# EasyEDA Pro project MIC.eprj

# Schematic Schematic1
Board Name: Board1; Create Date: 2024-11-22; Page Name: P1; Project Name: MIC; Schematic Name: Schematic1; Update Date: 2024-12-03; Company: 嘉立创EDA; Page Size: A4; Version: V1.0
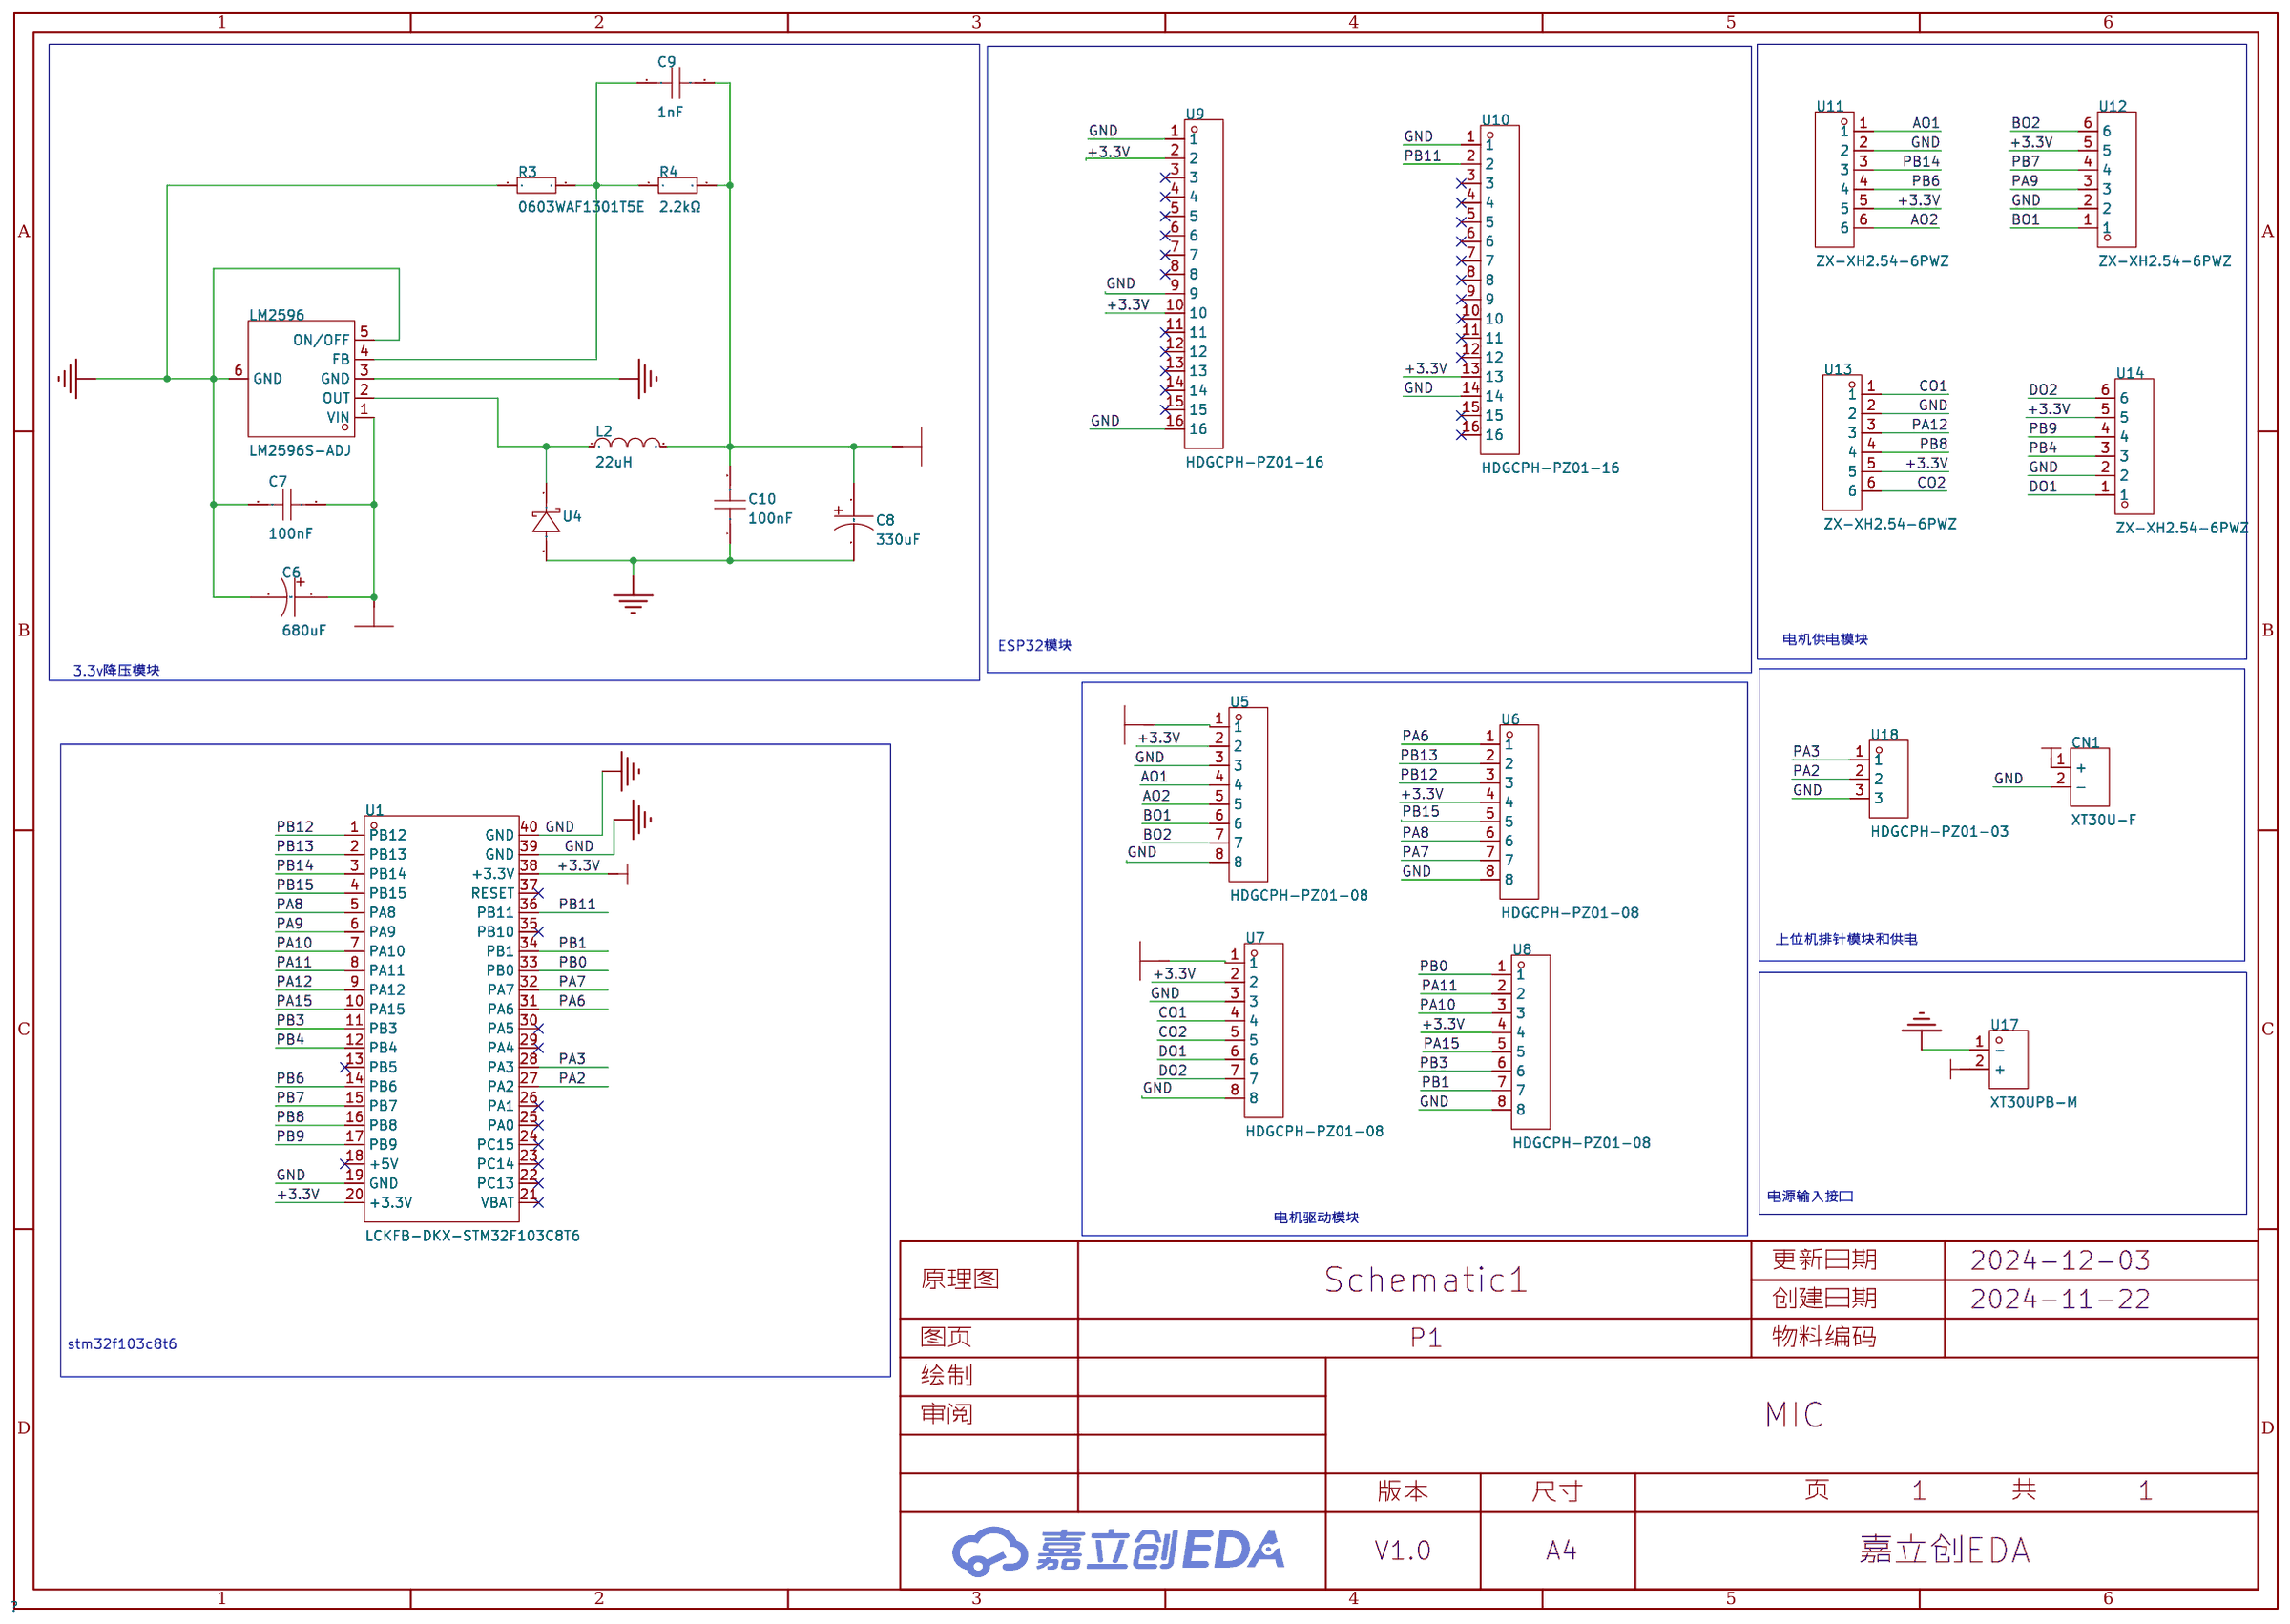
[diagram p0: schematic sheet]

## Parts
C6  680uF  [CAP-TH_BD10.0-P5.00-D1.0-FD]
C7  100nF  [C0805]
C8  330uF  [CAP-TH_BD10.0-P5.00-D1.0-FD]
C9  1nF  [C0603]
C10  100nF  [C0603]
CN1  XT30U-F  [CONN-TH_XT30U-F]
L2  22uH  [IND-SMD_L7.3-W6.6_MHCI06030]
LM2596  LM2596S-ADJ  [TO-263-5_L10.0-W8.4-P1.70-LS15.3-BR]
R3  0603WAF1301T5E  [R0603]
R4  2.2kΩ  [R0603]
U1  LCKFB-DKX-STM32F103C8T6  [CONN-TH_L53.3-W22.9_STM32F103C8T6-CARD]
U4  CDBC540-G  [SMC_L6.9-W5.9-LS7.9-RD]
U5  HDGCPH-PZ01-08  [HDR-TH_8P-P2.54-V-M]
U6  HDGCPH-PZ01-08  [HDR-TH_8P-P2.54-V-M]
U7  HDGCPH-PZ01-08  [HDR-TH_8P-P2.54-V-M]
U8  HDGCPH-PZ01-08  [HDR-TH_8P-P2.54-V-M]
U9  HDGCPH-PZ01-16  [HDR-TH_16P-P2.54-V-M_1]
U10  HDGCPH-PZ01-16  [HDR-TH_16P-P2.54-V-M_1]
U11  ZX-XH2.54-6PWZ  [CONN-TH_6P-P2.50_ZX-XH2.54-6PWZ]
U12  ZX-XH2.54-6PWZ  [CONN-TH_6P-P2.50_ZX-XH2.54-6PWZ]
U13  ZX-XH2.54-6PWZ  [CONN-TH_6P-P2.50_ZX-XH2.54-6PWZ]
U14  ZX-XH2.54-6PWZ  [CONN-TH_6P-P2.50_ZX-XH2.54-6PWZ]
U17  XT30UPB-M  [CONN-TH_XT30UPB-M]
U18  HDGCPH-PZ01-03  [HDR-TH_3P-P2.54-V-M-3]

## Library data of the parts
C6 = LKME1601V681MF: 纹波电流:2.12A 100kHz;容值:680uF;电容体直径:10mm;电容体长度:16mm;等效串联电阻:-;精度:±20%;工作温度:-;脚间距:5mm;额定电压:35V;工作寿命:10000hrs 105℃;; LCSC Part Name: 680uF 35V; Supplier Part: C442883; Manufacturer: Ymin(永铭); Supplier Footprint: 径向引线,10x16mm; JLCPCB Part Class: Extended Part; Datasheet: https://atta.szlcsc.com/upload/public/pdf/source/20191118/C442883_BAFD5D3D4BE15482383085AB86932EA1.pdf; Supplier: LCSC; Ripple Current: 2.12A 100kHz; φD: 10mm; L: 16mm; Tolerance: ±20%; Lead Spacing: 5mm; Rated Voltage: 35V; Lifetime @ Temp: 10000hrs 105℃
C7 = CC0805KKX7R0BB104: LCSC Part Name: 100nF ±10% 100V; Supplier Part: C106243; Manufacturer: YAGEO(国巨); Supplier Footprint: 0805; JLCPCB Part Class: Extended Part; Datasheet: https://atta.szlcsc.com/upload/public/pdf/source/20170505/1493951378248.pdf; Supplier: LCSC; Tolerance: ±10%; Voltage Rated: 100V; Temperature Coefficient: X7R
C8 = ERE1HM331G16OT: LCSC Part Name: 330uF 50V; Supplier Part: C106503; Manufacturer: AISHI(艾华集团); Supplier Footprint: 径向引线,10x16mm; JLCPCB Part Class: Extended Part; Datasheet: https://atta.szlcsc.com/upload/public/pdf/source/20170415/1492238008473.pdf; Supplier: LCSC; L: 16mm; Lifetime @ Temp: 3000hrs 105℃; Rated Voltage: 50V; Tolerance: ±20%; φD: 10mm; Lead Spacing: 5mm
C9 = CL10B102KB8NNNC: LCSC Part Name: 1nF ±10% 50V; Supplier Part: C1588; Manufacturer: SAMSUNG(三星); Supplier Footprint: 0603; JLCPCB Part Class: Basic Part; Datasheet: https://atta.szlcsc.com/upload/public/pdf/source/20160103/1457707679526.pdf; Supplier: LCSC; Tolerance: ±10%; Voltage Rated: 50V; Temperature Coefficient: X7R
C10 = CC0603KRX7R9BB104: LCSC Part Name: 100nF ±10% 50V; Supplier Part: C14663; Manufacturer: YAGEO(国巨); Supplier Footprint: 0603; JLCPCB Part Class: Basic Part; Datasheet: https://atta.szlcsc.com/upload/public/pdf/source/20170116/1484561234239.pdf; Supplier: LCSC; Tolerance: ±10%; Voltage Rated: 50V; Temperature Coefficient: X7R
CN1 = XT30U-F: LCSC Part Name: AMASS(艾迈斯)轻量版锂电池插头母头 XT30U-F; Supplier Part: C99102; Manufacturer: AMASS(艾迈斯); JLCPCB Part Class: Extended Part; Datasheet: https://atta.szlcsc.com/upload/public/pdf/source/20190916/C428721_B0ECB8C5937139CEFE8736D2D3175B0E.pdf; Supplier: LCSC; Brand: 艾迈斯; Type: 插头; Colour: 黄色; InterfaceType: 母头
L2 = SMMS0630-220M: LCSC Part Name: 22uH ±20%; Supplier Part: C128694; Manufacturer: SXN(顺翔诺); Supplier Footprint: SMD,7.3x6.6x3mm; JLCPCB Part Class: Extended Part; Datasheet: https://atta.szlcsc.com/upload/public/pdf/source/20210810/BBF24330FB2F5029F637830BA9C42C0D.pdf; Supplier: LCSC; Tolerance: ±20%
LM2596 = LM2596S-ADJ_C5349987: 功能类型:降压型;输出类型:可调;输入电压:40V;输出电压:1.23V~37V;输出电流(最大值):3.5A;; Supplier Part: C5349987; Manufacturer: HXY MOSFET(华轩阳电子); Supplier Footprint: TO-263-5L; JLCPCB Part Class: 扩展库; Datasheet: https://atta.szlcsc.com/upload/public/pdf/source/20230111/199BC35A7A4D0647B85E7DE5CE9FEA7F.pdf; Supplier: LCSC; Function: 降压型; Output Type: 可调; Input Voltage: 40V; Output Voltage: 1.23V~37V; Output Current (Max): 3.5A; Operating Temperature: -40℃~+125℃; Number of Outputs: 1; Switch tube (built-in/external): 内置
R3 = 0603WAF1301T5E: LCSC Part Name: 1.3KΩ(1301) ±1% 编带; Supplier Part: C22767; Manufacturer: UNI-ROYAL(厚声); Supplier Footprint: 0603; JLCPCB Part Class: Extended Part; Datasheet: https://atta.szlcsc.com/upload/public/pdf/source/20170920/C22767_1505887454633980565.pdf; Supplier: LCSC
R4 = RC0603JR-072K2L: LCSC Part Name: 2.2kΩ ±5%; Supplier Part: C113303; Manufacturer: YAGEO(国巨); Supplier Footprint: 0603; JLCPCB Part Class: Extended Part; Datasheet: https://atta.szlcsc.com/upload/public/pdf/source/20170620/1497944742771.pdf; Supplier: LCSC; Tolerance: ±5%; Power(Watts): 100mW; Temperature Coefficient: ±100ppm/℃; Overload Voltage (Max): 75V; Operating Temperature Range: -55℃~+155℃
U1 = LCKFB-DKX-STM32F103C8T6: LCSC Part Name: 立创·地阔星-STM32F103C8T6开发板; Supplier Part: C22396880; Manufacturer: 立创开发板; JLCPCB Part Class: Extended Part; Datasheet: https://atta.szlcsc.com/upload/public/pdf/source/20240801/7EEF69F7480DF7C6DA98696664D658D4.pdf; Supplier: LCSC
U4 = CDBC540-G: 正向压降(Vf):550mV@5A;直流反向耐压(Vr):40V;平均整流电流(Io):5A;; LCSC Part Name: 电压:40V 电流:5A; Supplier Part: C7228248; Manufacturer: Comchip(典琦); Supplier Footprint: DO-214AB(SMC); JLCPCB Part Class: 扩展库; Datasheet: https://atta.szlcsc.com/upload/public/pdf/source/20231205/90395A76CAA79AC143B897FCFF45401B.pdf; Supplier: LCSC; Forward Voltage (Vf@If): 550mV@5A; Reverse Voltage (Vr): 40V; Average Rectified Current (Io): 5A; Reverse Leakage Current (Ir): 500uA@40V
U5-U8 = HDGCPH-PZ01-08: LCSC Part Name: 2.54单排针直插排针L11.6/3.0 1x8P; Supplier Part: C19190974; Manufacturer: HDGC(华德共创); Supplier Footprint: 插件,P=2.54mm; JLCPCB Part Class: Extended Part; Datasheet: https://atta.szlcsc.com/upload/public/pdf/source/20231110/9EB16C2E1D607182756B4718BDE6A9C4.pdf; Supplier: LCSC
U9 U10 = HDGCPH-PZ01-16: LCSC Part Name: 2.54单排针直插排针L11.6/3.0 1x16P; Supplier Part: C19190982; Manufacturer: HDGC(华德共创); Supplier Footprint: 插件,P=2.54mm; JLCPCB Part Class: Extended Part; Datasheet: https://atta.szlcsc.com/upload/public/pdf/source/20231110/9EB16C2E1D607182756B4718BDE6A9C4.pdf; Supplier: LCSC
U11-U14 = ZX-XH2.54-6PWZ: Supplier Part: C7429645; Manufacturer: Megastar(兆星); Supplier Footprint: 弯插,P=2.54mm; JLCPCB Part Class: Extended Part; Datasheet: https://atta.szlcsc.com/upload/public/pdf/source/20230619/9057EB94260093B1525D11E652DE2D7A.pdf; Supplier: LCSC; Pins Structure: 1x6P; Pitch: 2.54mm; Mounting Style: 弯插; Reference Series: XH; Number of Pins: 6P; Number of Rows: 1; Number of PINs Per Row: 6; Current Rating (Max): 3A; Contact Material: 黄铜; Contact Plating: 锡; Operating Temperature Range: -25℃~+85℃
U17 = XT30UPB-M: Supplier Part: C428721; Manufacturer: AMASS(艾迈斯); JLCPCB Part Class: Extended Part; Datasheet: https://atta.szlcsc.com/upload/public/pdf/source/20190916/C428721_B0ECB8C5937139CEFE8736D2D3175B0E.pdf; Supplier: LCSC
U18 = HDGCPH-PZ01-03: LCSC Part Name: 2.54单排针直插排针L11.6/3.0 1x3P; Supplier Part: C19190969; Manufacturer: HDGC(华德共创); Supplier Footprint: 插件,P=2.54mm; JLCPCB Part Class: Extended Part; Datasheet: https://atta.szlcsc.com/upload/public/pdf/source/20231110/9EB16C2E1D607182756B4718BDE6A9C4.pdf; Supplier: LCSC

## Nets
+3.3V: C8.1 C9.2 C10.2 L2.2 R4.2 U1.20(+3.3V) U1.38(+3.3V) U5.2 U6.4 U7.2 U8.4 U9.2 U9.10 U10.13 U11.5 U12.5 U13.5 U14.5
+12V: C6.1 C7.2 CN1.1(+) LM2596.1(VIN) U5.1 U7.1 U17.2(+)
GND: C6.2 C7.1 C8.2 C10.1 CN1.2(-) LM2596.3(GND) LM2596.5(ON/OFF) LM2596.6(GND) R3.1 U1.19(GND) U1.39(GND) U1.40(GND) U4.2 U5.3 U5.8 U6.8 U7.3 U7.8 U8.8 U9.1 U9.9 U9.16 U10.1 U10.14 U11.2 U12.2 U13.2 U14.2 U17.1(-) U18.3
AO1: U5.4 U11.1
AO2: U5.5 U11.6
BO1: U5.6 U12.1
BO2: U5.7 U12.6
CO1: U7.4 U13.1
CO2: U7.5 U13.6
DO1: U7.6 U14.1
DO2: U7.7 U14.6
PA2: U1.27(PA2) U18.2
PA3: U1.28(PA3) U18.1
PA6: U1.31(PA6) U6.1
PA7: U1.32(PA7) U6.7
PA8: U1.5(PA8) U6.6
PA9: U1.6(PA9) U12.3
PA10: U1.7(PA10) U8.3
PA11: U1.8(PA11) U8.2
PA12: U1.9(PA12) U13.3
PA15: U1.10(PA15) U8.5
PB0: U1.33(PB0) U8.1
PB1: U1.34(PB1) U8.7
PB3: U1.11(PB3) U8.6
PB4: U1.12(PB4) U14.3
PB6: U1.14(PB6) U11.4
PB7: U1.15(PB7) U12.4
PB8: U1.16(PB8) U13.4
PB9: U1.17(PB9) U14.4
PB11: U1.36(PB11) U10.2
PB12: U1.1(PB12) U6.3
PB13: U1.2(PB13) U6.2
PB14: U1.3(PB14) U11.3
PB15: U1.4(PB15) U6.5
$1N1023: L2.1 LM2596.2(OUT) U4.1
$1N1027: C9.1 LM2596.4(FB) R3.2 R4.1

Not connected (* = marked no-connect by the designer): U1 13(PB5)* 18(+5V)* 21(VBAT)* 22(PC13)* 23(PC14)* 24(PC15)* 25(PA0)* 26(PA1)* 29(PA4)* 30(PA5)* 35(PB10)* 37(RESET)*; U9 3* 4* 5* 6* 7* 8* 11* 12* 13* 14* 15*; U10 3* 4* 5* 6* 7* 8* 9* 10* 11* 12* 15* 16*

## Notes on the sheet
- ESP32模块
- 电机供电模块
- 3.3v降压模块
- 上位机排针模块和供电
- 电源输入接口
- 电机驱动模块
- stm32f103c8t6

# Board PCB1
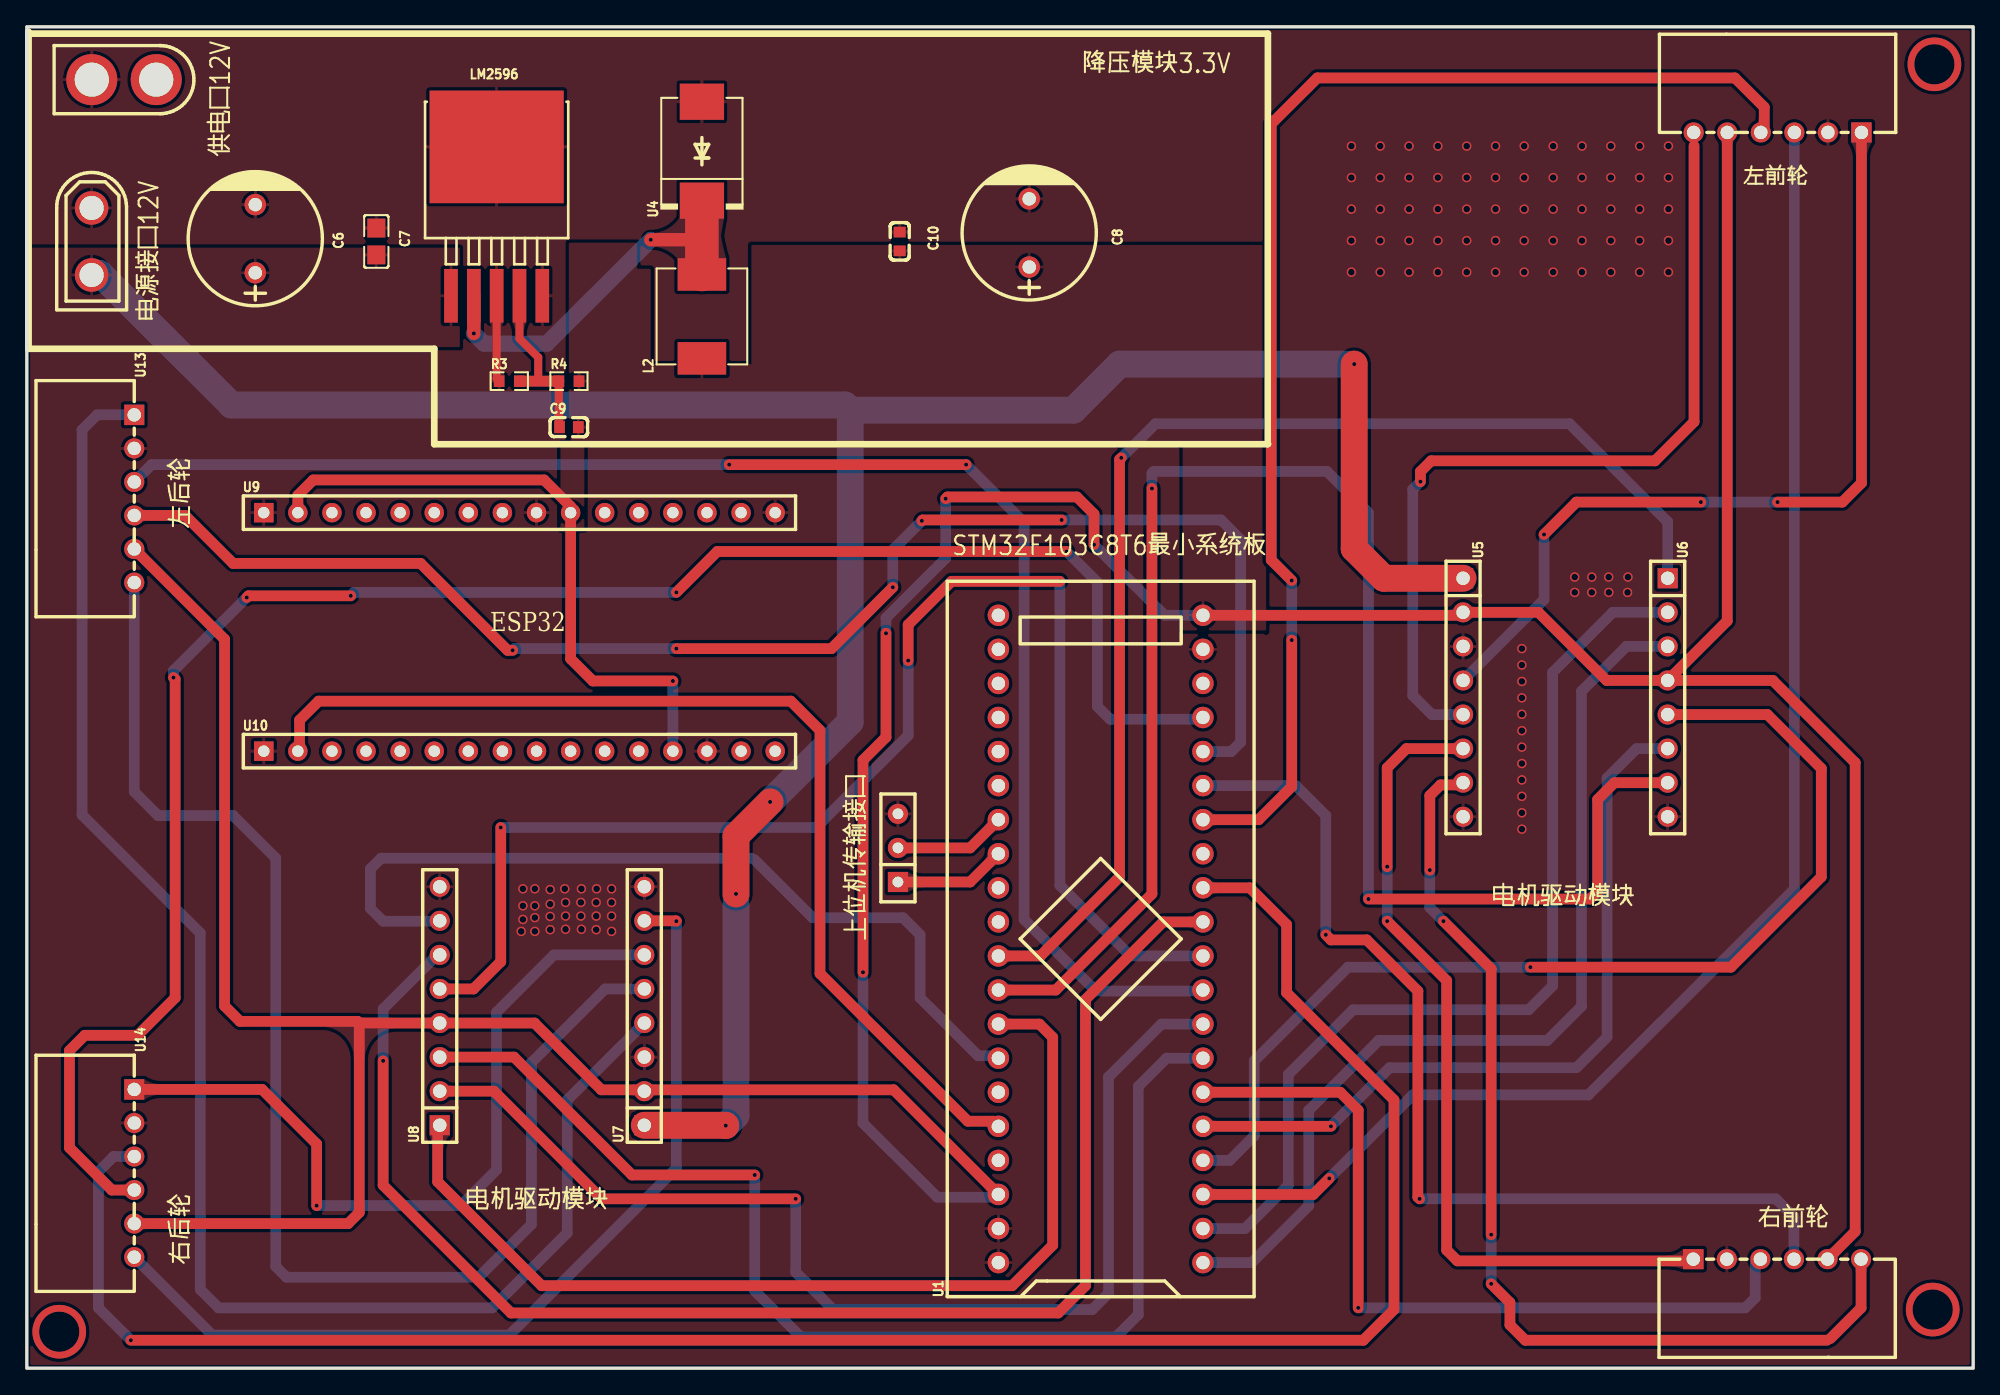
[diagram p1: board, top side]
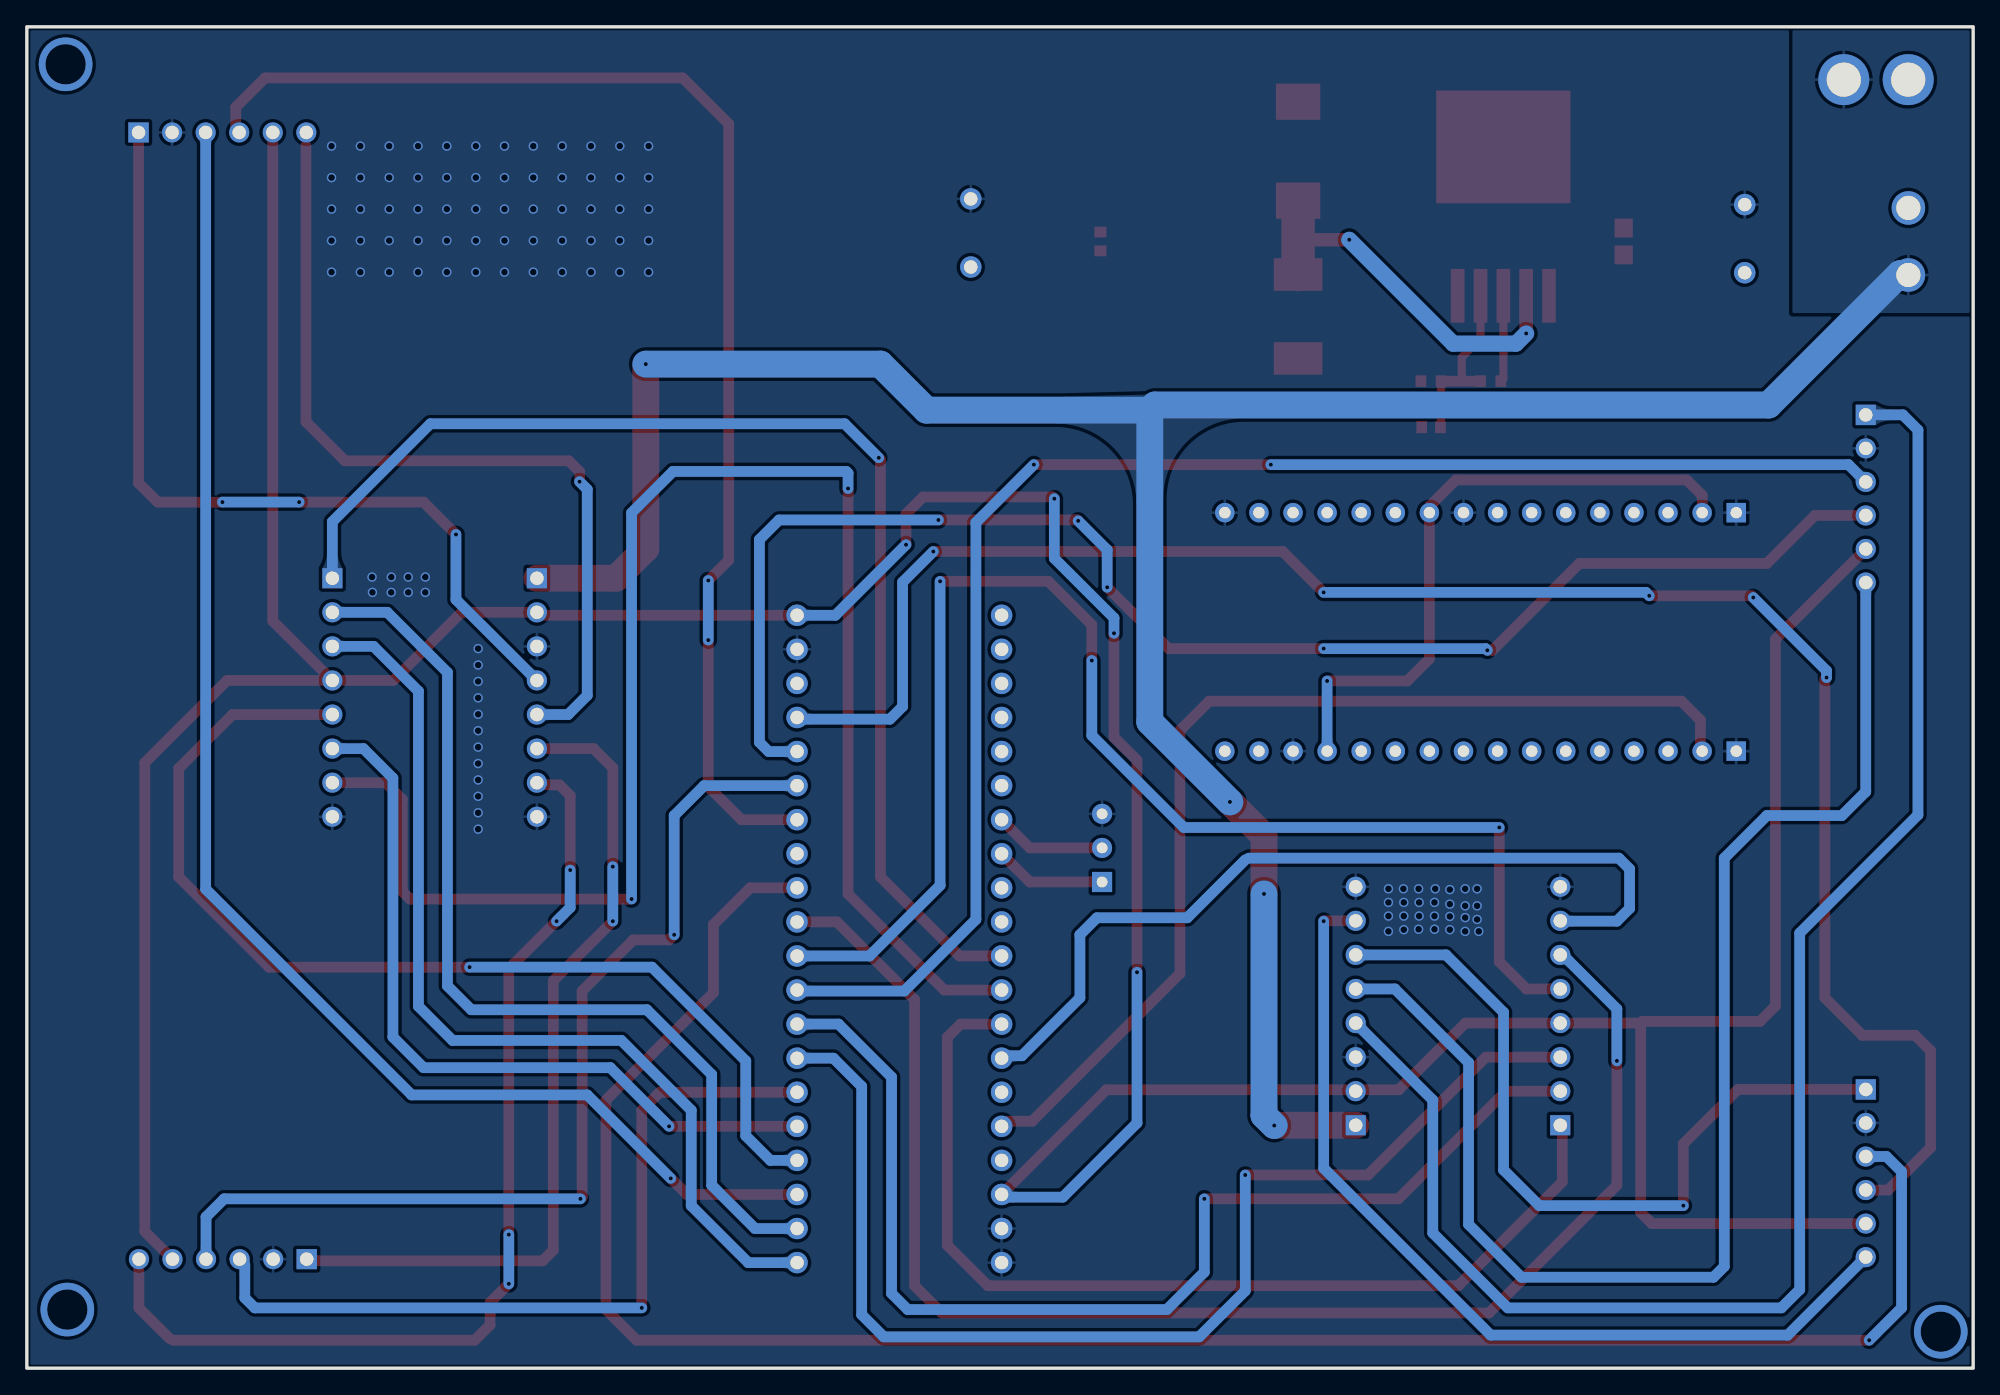
[diagram p2: board, bottom side, seen from below]

Outline 145 x 100 mm; copper layers: Top Layer, Bottom Layer. Coordinates in mm from the lower left corner of the outline.
Outline path: rectangle 0,100 145,0
Stack: Top Layer 0.035mm / Dielectric1 1.51mm FR4 er 4.5 / Bottom Layer 0.035mm

## Design rules (mm)
template: JLCPCB Capability(Two Layers Board)
spacing copperThickness1oz (default): track to track 0.102, other pairs 0.152 to 0.3
spacing copperThickness2oz: track to track 0.203, other pairs 0.152 to 0.3
track width copperThickness1oz (default): min 0.127, default 0.254, max 2.54
track width copperThickness2oz: min 0.203, default 0.254, max 2.54
differential pair differentialPair (default): width min 0.127, default 0.254, max 2.54; gap min 0.152, default 0.152
via viaSize (default): diameter min 0.5, default 0.61, max 10; hole min 0.3, default 0.305, max 6.3

## Placement (name value [footprint] x y rotation side)
C6  680uF  [CAP-TH_BD10.0-P5.00-D1.0-FD]  17.02 84.2 90 top
C7  100nF  [C0805]  26.03 84 270 top
C8  330uF  [CAP-TH_BD10.0-P5.00-D1.0-FD]  74.68 84.63 90 top
C9  1nF  [C0603]  40.39 70.16 0 top
C10  100nF  [C0603]  65.02 84 270 top
CN1  XT30U-F  [CONN-TH_XT30U-F]  7.24 96.06 0 top
L2  22uH  [IND-SMD_L7.0-W6.6_FXL0630]  50.29 78.41 90 top
LM2596  LM2596S-ADJ  [TO-263-5_L10.0-W8.4-P1.70-LS15.3-BR]  35 85.5 270 top
R3  0603WAF1301T5E  [R0603]  35.94 73.58 0 top
R4  2.2kΩ  [R0603]  40.39 73.58 0 top
U1  LCKFB-DKX-STM32F103C8T6  [CONN-TH_L53.3-W22.9_STM32F103C8T6-CARD]  80 32 90 top
U4  CDBC540-G  [SMC_L6.9-W5.9-LS7.9-RD]  50.29 90.73 90 top
U5  HDGCPH-PZ01-08  [HDR-TH_8P-P2.54-V-M]  107 50 270 top
U6  HDGCPH-PZ01-08  [HDR-TH_8P-P2.54-V-M]  122.24 50 270 top
U7  HDGCPH-PZ01-08  [HDR-TH_8P-P2.54-V-M]  46 27 90 top
U8  HDGCPH-PZ01-08  [HDR-TH_8P-P2.54-V-M]  30.76 27 90 top
U9  HDGCPH-PZ01-16  [HDR-TH_16P-P2.54-V-M_1]  36.7 63.78 0 top
U10  HDGCPH-PZ01-16  [HDR-TH_16P-P2.54-V-M_1]  36.7 46 0 top
U12  ZX-XH2.54-6PWZ  [CONN-TH_6P-P2.50_ZX-XH2.54-6PWZ]  130.4 8.13 0 top
U13  ZX-XH2.54-6PWZ  [CONN-TH_6P-P2.50_ZX-XH2.54-6PWZ]  8 64.82 270 top
U14  ZX-XH2.54-6PWZ  [CONN-TH_6P-P2.50_ZX-XH2.54-6PWZ]  8 14.53 270 top
U17  XT30UPB-M  [CONN-TH_XT30UPB-M]  4.83 84 270 top
U18  HDGCPH-PZ01-03  [HDR-TH_3P-P2.54-V-M-3]  64.9 38.79 90 top
左前轮  ZX-XH2.54-6PWZ  [CONN-TH_6P-P2.50_ZX-XH2.54-6PWZ]  130.43 92.13 180 top

## Footprints (pads in the part's own frame, mm; a bottom-side part is the same pattern mirrored in y, then rotated)
C0603
  rect 0.8x0.9 smd: 1(-0.7,0) 2(0.7,0)
C0805
  rect 1.41x1.35 smd: 1(-1,0) 2(1,0)
CAP-TH_BD10.0-P5.00-D1.0-FD
  round 1.6 hole 1: 1(-2.54,0) 2(2.54,0)
CONN-TH_6P-P2.50_ZX-XH2.54-6PWZ
  rect 1.524x1.5 hole 1: 1(-6.25,0)
  round 1.5 hole 1: 2(-3.75,0) 3(-1.25,0) 4(1.25,0) 5(3.75,0) 6(6.25,0)
CONN-TH_L53.3-W22.9_STM32F103C8T6-CARD
  round 1.6 hole 1: 1(-24.13,-7.62) 2(-21.59,-7.62) 3(-19.05,-7.62) 4(-16.51,-7.62) 5(-13.97,-7.62) 6(-11.43,-7.62) 7(-8.89,-7.62) 8(-6.35,-7.62) 9(-3.81,-7.62) 10(-1.27,-7.62) 11(1.27,-7.62) 12(3.81,-7.62) 13(6.35,-7.62) 14(8.89,-7.62) 15(11.43,-7.62) 16(13.97,-7.62) 17(16.51,-7.62) 18(19.05,-7.62) 19(21.59,-7.62) 20(24.13,-7.62) 21(24.13,7.62) 22(21.59,7.62) 23(19.05,7.62) 24(16.51,7.62) 25(13.97,7.62) 26(11.43,7.62) 27(8.89,7.62) 28(6.35,7.62) 29(3.81,7.62) 30(1.27,7.62) 31(-1.27,7.62) 32(-3.81,7.62) 33(-6.35,7.62) 34(-8.89,7.62) 35(-11.43,7.62) 36(-13.97,7.62) 37(-16.51,7.62) 38(-19.05,7.62) 39(-21.59,7.62) 40(-24.13,7.62)
CONN-TH_XT30U-F
  round 3.8 hole 2.54: 1(2.4,0) 2(-2.4,0)
CONN-TH_XT30UPB-M
  round 2.499 hole 1.801: 1(-2.499,0) 2(2.499,0)
HDR-TH_3P-P2.54-V-M-3
  rect 1.5x1.5 hole 0.8: 1(-2.54,0)
  round 1.5 hole 0.8: 2(0,0) 3(2.54,0)
HDR-TH_8P-P2.54-V-M
  rect 1.5x1.5 hole 1: 1(-8.89,0)
  round 1.5 hole 1: 2(-6.35,0) 3(-3.81,0) 4(-1.27,0) 5(1.27,0) 6(3.81,0) 7(6.35,0) 8(8.89,0)
HDR-TH_16P-P2.54-V-M_1
  rect 1.45x1.45 hole 0.85: 1(-19.05,0)
  round 1.45 hole 0.85: 2(-16.51,0) 3(-13.97,0) 4(-11.43,0) 5(-8.89,0) 6(-6.35,0) 7(-3.81,0) 8(-1.27,0) 9(1.27,0) 10(3.81,0) 11(6.35,0) 12(8.89,0) 13(11.43,0) 14(13.97,0) 15(16.51,0) 16(19.05,0)
IND-SMD_L7.0-W6.6_FXL0630
  rect 2.424x3.62 smd: 1(3.128,0) 2(-3.128,0)
R0603
  rect 0.806x0.864 smd: 1(-0.753,0) 2(0.753,0)
SMC_L6.9-W5.9-LS7.9-RD
  rect 2.7x3.3 smd: 1(-3.687,0) 2(3.687,0)
TO-263-5_L10.0-W8.4-P1.70-LS15.3-BR
  rect 4x1.02 smd: 1(5.55,-3.4) 2(5.55,-1.7) 3(5.55,0) 4(5.55,1.7) 5(5.55,3.4)
  rect 8.4x10 smd: 6(-5.55,0)

## Nets
As in the schematic, except:
+3.3V: C8.1 C9.2 C10.2 L2.2 R4.2 U1.20 U1.38 U5.2 U6.4 U7.2 U8.4 U9.2 U9.10 U10.13 U12.5 U13.5 U14.5 左前轮.5
GND: C6.2 C7.1 C8.2 C10.1 CN1.2 LM2596.3 LM2596.5 LM2596.6 R3.1 U1.19 U1.39 U1.40 U4.2 U5.3 U5.8 U6.8 U7.3 U7.8 U8.8 U9.1 U9.9 U9.16 U10.1 U10.14 U12.2 U13.2 U14.2 U17.1 U18.3 左前轮.2
AO1: U5.4 左前轮.1
AO2: U5.5 左前轮.6
PB6: U1.14 左前轮.4
PB14: U1.3 左前轮.3

Pads without a net: U1 13 18 21 22 23 24 25 26 29 30 35 37; U9 3 4 5 6 7 8 11 12 13 14 15; U10 3 4 5 6 7 8 9 10 11 12 15 16

## Via types
v1: diameter 4, hole 3, Top Layer to Bottom Layer, 3 vias
v2: diameter 0.7, hole 0.5, Top Layer to Bottom Layer, 108 vias
v3: diameter 0.61, hole 0.305, Top Layer to Bottom Layer, 53 vias

## Routing (per net, layer and track width the routed paths; a pad name or vN(x,y) marks a point on that pad's centre or on a via; arc(x,y) is an arc through that point)
+3.3V: length 399.2
  Top Layer w0.8: U1.38 64.58,20.75 45.9,20.75 ; U14.5 23.94,10.78 24.77,11.61 24.77,25.73 ; v3(64.01,54.79) 64.01,47.04 62.29,45.33 v3(62.29,29.51) ; v3(68.45,64.82) 68.58,64.95 78.23,64.95 79.5,63.68 v3(79.5,61.39) ; 左前轮.5 126.68,55.71 U6.4 ; 24.77,25.73 U8.4 37.82,25.73 42.8,20.75 45.9,20.75 ; 24.77,25.73 24.64,25.86 15.88,25.86 14.73,27 14.73,54.34 U13.5 ; U6.4 117.69,51.27 112.61,56.35 U5.2 106.78,56.13 U1.20 ; U6.4 130.08,51.27 136.21,45.14 136.21,10.19 U12.5 ; U9.2 20.19,65.08 21.33,66.22 38.54,66.22 40.51,64.25 U9.10 40.51,52.89 42.16,51.23 v3(48.13,51.23) ; 45.9,20.75 U7.2
  Bottom Layer w0.8: v3(79.5,61.39) 84.76,56.13 U1.20 ; v3(68.45,64.82) 68.45,60.38 64.01,55.93 v3(64.01,54.79) ; U1.38 72.18,12.75 67.82,12.75 62.29,18.28 v3(62.29,29.51) ; U10.13 v3(48.13,51.23)
+12V: length 185.7
  Top Layer w2: U5.1 101.09,58.89 98.89,61.09 v3(98.89,74.85) ; v3(52.83,35.36) 52.83,39.67 v3(55.37,42.22) ; U7.1 52.04,18.11 v3(52.07,18.09)
  Bottom Layer w2: v3(98.89,74.85) 81.41,74.85 77.98,71.42 61.34,71.42 ; 61.34,71.42 60.96,71.81 15.24,71.81 5.45,81.6 4.83,81.6 ; 61.34,71.42 61.34,48.18 v3(55.37,42.22) ; v3(52.07,18.09) 52.83,18.85 v3(52.83,35.36)
GND: length 6.4
  Top Layer w0.6: R3.1 35,73.77 LM2596.3
  vias: v2(36.83,32.56) v2(36.96,35.74) v2(36.96,34.47) v2(36.96,33.45) v2(37.85,35.74) v2(37.85,34.47) v2(37.85,33.59) v2(37.85,32.56) v2(38.99,35.68) v2(38.99,34.59) v2(38.99,33.68) v2(38.99,32.69) v2(40.07,35.74) v2(40.13,34.72) v2(40.13,33.71) v2(40.13,32.72) v2(41.31,35.74) v2(41.28,34.72) v2(41.28,33.71) v2(41.31,32.72) v2(42.45,35.74) v2(42.42,34.72) v2(42.42,33.71) v2(42.42,32.69) v2(43.56,35.74) v2(43.56,34.72) v2(43.56,33.71) v2(43.56,32.56) v2(98.68,91.11) v2(98.68,88.76) v2(98.68,86.41) v2(98.68,84.06) v2(98.68,81.71) v2(100.83,91.11) v2(100.83,88.76) v2(100.83,86.41) v2(100.83,84.06) v2(100.83,81.71) v2(102.97,91.11) v2(102.97,88.76) v2(102.97,86.41) v2(102.97,84.06) v2(102.97,81.71) v2(105.12,91.11) v2(105.12,88.76) v2(105.12,86.41) v2(105.12,84.06) v2(105.12,81.71) v2(107.27,91.11) v2(107.27,88.76) v2(107.27,86.41) v2(107.27,84.06) v2(107.27,81.71) v2(109.42,91.11) v2(109.42,88.76) v2(109.42,86.41) v2(109.42,84.06) v2(109.42,81.71) v2(111.38,53.64) v2(111.38,52.42) v2(111.38,51.2) v2(111.38,49.97) v2(111.38,48.75) v2(111.38,47.53) v2(111.38,46.3) v2(111.38,45.08) v2(111.38,43.85) v2(111.38,42.63) v2(111.38,41.41) v2(111.38,40.18) v2(111.55,91.11) v2(111.55,88.76) v2(111.55,86.41) v2(111.55,84.06) v2(111.55,81.71) v2(113.71,91.11) v2(113.71,88.76) v2(113.71,86.41) v2(113.71,84.06) v2(113.71,81.71) v2(115.32,58.98) v2(115.32,57.84) v2(115.86,91.11) v2(115.86,88.76) v2(115.86,86.41) v2(115.86,84.06) v2(115.86,81.71) v2(116.59,58.98) v2(116.59,57.84) v2(117.85,58.98) v2(117.86,57.84) v2(118.01,91.11) v2(118.01,88.76) v2(118.01,86.41) v2(118.01,84.06) v2(118.01,81.71) v2(119.28,58.98) v2(119.25,57.84) v2(120.15,91.11) v2(120.15,88.76) v2(120.15,86.41) v2(120.15,84.06) v2(120.15,81.71) v2(122.3,91.11) v2(122.3,88.76) v2(122.3,86.41) v2(122.3,84.06) v2(122.3,81.71)
(no net):
  vias: v1(2.41,2.72) v1(141.99,4.37) v1(142.11,97.21)
AO1: length 64.8
  Top Layer w0.8: 左前轮.1 136.68,65.99 135.25,64.57 v3(130.43,64.57) ; v3(113.03,62.15) 115.44,64.57 v3(124.71,64.57)
  Bottom Layer w0.8: v3(113.03,62.15) 113.03,57.3 U5.4 ; v3(130.43,64.57) v3(124.71,64.57)
AO2: length 63.8
  Top Layer w0.8: v3(103.82,66.09) 103.82,66.84 104.62,67.64 121.3,67.64 124.21,70.55 124.21,91.13
  Bottom Layer w0.8: U5.5 104.67,48.73 103.25,50.15 103.25,65.52 v3(103.82,66.09)
BO1: length 62.8
  Top Layer w0.8: v3(101.35,33.33) 105.78,28.89 105.78,8.8 106.58,8 124.02,8 U12.1 ; v3(101.35,37.39) 101.35,44.75 102.78,46.19 U5.6
  Bottom Layer w0.8: v3(101.35,33.33) v3(101.35,37.39)
BO2: length 75.8
  Top Layer w0.8: 134.37,2.21 136.65,4.49 U12.6 ; 134.11,2.08 111.63,2.08 110.49,3.23 110.49,4.89 v3(109.09,6.29) ; v3(105.54,33.33) 109.09,29.77 v3(109.09,9.96) ; U5.7 106.84,43.48 105.32,43.48 104.52,42.69 v3(104.52,37.14)
  Bottom Layer w0.8: v3(104.52,37.14) 104.52,34.34 v3(105.54,33.33) ; v3(109.09,9.96) v3(109.09,6.29)
CO1: length 120.3
  Bottom Layer w0.8: U7.4 40.26,19.99 40.26,10.08 34.67,4.5 14.29,4.5 12.92,5.86 12.92,32.44 4.11,41.25 4.11,69.95 5.23,71.07 U13.1
CO2: length 102.4
  Bottom Layer w0.8: U13.6 8,42.98 9.78,41.2 15.37,41.2 18.54,38.02 18.54,7.58 19.34,6.78 33.66,6.78 37.59,10.72 37.59,22.78 43.08,28.27 U7.5
DO1: length 58.9
  Top Layer w0.8: U14.1 17.53,20.78 21.59,16.72 v3(21.59,12.12)
  Bottom Layer w0.8: v3(21.59,12.12) 32.32,12.12 34.99,14.78 34.99,26.53 39.27,30.81 U7.6
DO2: length 68.8
  Top Layer w0.8: v3(48.39,33.33) 48.36,33.35 U7.7
  Bottom Layer w0.8: U14.6 13.82,2.46 35.94,2.46 48.39,14.91 v3(48.39,33.33)
PA2: length 8.4
  Top Layer w0.8: U1.27 70.28,38.79 U18.2
PA3: length 8.4
  Top Layer w0.8: U1.28 70.28,36.25 U18.1
PA6: length 91.8
  Top Layer w0.8: U1.31 75.51,30.73 81.41,36.63 81.41,67.74 v3(81.53,67.87)
  Bottom Layer w0.8: v3(81.53,67.87) 84.07,70.41 114.94,70.41 122.24,63.1 U6.1
PA7: length 121.9
  Top Layer w0.8: U1.32 76.65,28.19 83.82,35.36 v3(83.82,65.58) ; U6.7 118.28,43.65 117.02,42.4 117.02,35.54 116.46,34.98 v3(99.95,34.98)
  Bottom Layer w0.8: v3(83.82,65.58) 83.82,66.73 83.95,66.85 96.86,66.85 99.95,63.77 v3(99.95,34.98)
PA8: length 57.6
  Top Layer w0.8: U1.5 v3(97.16,18.03)
  Bottom Layer w0.8: U6.6 119.93,46.19 117.73,43.99 117.73,24.69 115.44,22.4 101.53,22.4 v3(97.16,18.03)
PA9: length 59.2
  Top Layer w0.8: v3(99.19,4.5) 99.19,19.23 97.84,20.57 U1.6
  Bottom Layer w0.8: v3(99.19,4.5) 128.02,4.5 128.76,5.24 128.76,7.74
PA10: length 89.1
  Top Layer w0.8: v3(54.23,14.4) 45.08,14.4 36.3,23.19 U8.3
  Bottom Layer w0.8: U1.7 84.91,23.11 82.8,21.01 82.8,3.99 81.15,2.34 57.66,2.34 54.23,5.77 v3(54.23,14.4)
PA11: length 85.1
  Top Layer w0.8: v3(57.28,12.62) 42.82,12.62 34.8,20.65 U8.2
  Bottom Layer w0.8: U1.8 84.53,25.65 80.58,21.7 80.58,5.58 79.38,4.37 60.07,4.37 57.28,7.16 v3(57.28,12.62)
PA12: length 113.8
  Top Layer w0.8: v3(69.98,67.36) v3(52.32,67.36)
  Bottom Layer w0.8: v3(52.32,67.36) 9.29,67.36 U13.3 ; v3(69.98,67.36) 74.29,63.04 74.29,33.45 79.63,28.12 87.55,28.12 U1.9
PA15: length 105
  Top Layer w0.8: U8.5 33.27,28.27 35.31,30.3 v3(35.31,40.31) ; v3(65.66,52.76) 65.66,55.42 68.9,58.66 v3(76.96,58.66)
  Bottom Layer w0.8: v3(76.96,58.66) 76.96,35.99 82.22,30.73 U1.10 ; v3(35.31,40.31) 58.8,40.31 65.66,47.17 v3(65.66,52.76)
PB0: length 74.5
  Top Layer w0.8: U8.1 30.61,17.96 30.61,13.89 38.35,6.15 73.41,6.15 76.43,9.17 76.43,24.66 75.44,25.65 U1.33
PB1: length 64.3
  Bottom Layer w0.8: 54.23,37.9 58.55,33.58 65.28,33.58 66.55,32.31 66.55,27.61 70.87,23.29 72.2,23.29 U1.34 ; U8.7 30.73,33.33 26.54,33.33 25.6,34.27 25.6,37.22 26.4,38.02 53.97,38.02
PB3: length 108.6
  Top Layer w0.8: U1.11 84.65,33.27 78.87,27.48 78.87,6.15 76.84,4.12 36.07,4.12 26.54,13.64 v3(26.54,22.91)
  Bottom Layer w0.8: U8.6 30.57,30.81 26.54,26.78 v3(26.54,22.91)
PB4: length 151.1
  Top Layer w0.8: v3(7.75,2.08) 99.57,2.08 101.85,4.37 101.85,19.99 93.85,27.99 93.85,33.07 91.11,35.81 U1.12
  Bottom Layer w0.8: U14.3 6.46,15.78 5.33,14.66 5.33,4.5 v3(7.75,2.08)
PB6: length 98.9
  Top Layer w0.8: v3(94.23,54.28) 94.23,43.36 91.77,40.89 U1.14 ; 左前轮.4 129.44,92.13 129.44,94.01 127.25,96.19 96.14,96.19 92.71,92.76 92.71,60.25 v3(94.23,58.72)
  Bottom Layer w0.8: v3(94.23,54.28) v3(94.23,58.72)
PB7: length 74.7
  Top Layer w0.8: v3(96.77,32.31) 97.16,31.93 99.82,31.93 103.63,28.12 103.63,12.75 v3(103.76,12.62)
  Bottom Layer w0.8: U12.4 131.65,11.28 130.3,12.62 v3(103.76,12.62) ; U1.15 94.54,43.43 96.77,41.2 v3(96.77,32.31)
PB8: length 111.1
  Top Layer w0.8: v3(36.19,53.52) 35.81,53.52 29.34,60 15.37,60 11.79,63.57 U13.4 ; v3(77.09,63.23) 66.74,63.23 v3(66.68,63.17) ; v3(48.39,53.64) 59.94,53.64 v3(64.52,58.22)
  Bottom Layer w0.8: v3(36.19,53.52) 36.32,53.64 v3(48.39,53.64) ; v3(66.68,63.17) 64.52,61.01 v3(64.52,58.22) ; U1.16 89.73,45.97 90.42,46.66 90.42,61.77 88.96,63.23 v3(77.09,63.23)
PB9: length 138.4
  Top Layer w0.8: v3(77.47,60.88) 51.44,60.88 v3(48.39,57.84) ; U14.4 6.33,13.28 3.17,16.43 3.17,23.67 4.32,24.82 8.25,24.82 11.05,27.61 11.05,51.36 v3(10.92,51.49) ; v3(24.13,57.58) 16.51,57.58 v3(16.38,57.45)
  Bottom Layer w0.8: v3(10.92,51.49) 10.92,51.99 v3(16.38,57.45) ; v3(77.47,60.88) 79.76,58.6 79.76,49.33 80.7,48.38 87.49,48.38 U1.17 ; v3(48.39,57.84) 24.38,57.84 v3(24.13,57.58)
PB11: length 78.8
  Top Layer w0.8: U10.2 20.32,46.13 20.32,48.31 21.73,49.73 56.91,49.73 59.09,47.55 59.09,29.42 70.1,18.41 72,18.41 U1.36
PB12: length 71.6
  Bottom Layer w0.8: U6.3 119.16,53.81 115.82,50.47 115.82,26.97 113.28,24.44 100.71,24.44 95.5,19.23 95.5,12.12 91.26,7.87 U1.1
PB13: length 72.2
  Bottom Layer w0.8: U6.2 118.15,56.35 113.66,51.87 113.66,28.5 111.89,26.72 98.81,26.72 93.98,21.9 93.98,13.64 90.75,10.41 U1.2
PB14: length 109.9
  Top Layer w0.8: U1.3 95.83,12.95 v3(97.03,14.15)
  Bottom Layer w0.8: 左前轮.3 131.68,35.72 116.33,20.37 103.25,20.37 v3(97.03,14.15)
PB15: length 79.3
  Top Layer w0.8: U6.5 129.67,48.73 133.69,44.71 133.69,36.63 126.96,29.9 v3(112.01,29.9)
  Bottom Layer w0.8: U1.4 89.61,15.49 91.44,17.32 91.44,22.91 98.43,29.9 v3(112.01,29.9)
$1N1023: length 27.9
  Top Layer w1: LM2596.2 v3(33.3,77.14) ; v3(46.48,84.12) 49.4,84.12
  Top Layer w2.5: U4.1 L2.1
  Bottom Layer w1.2: v3(46.48,84.12) 38.73,76.38 34.06,76.38 v3(33.3,77.14)
$1N1027: length 13.1
  Top Layer w0.6: 38.1,73.84 38.1,75.36 36.7,76.76 LM2596.4 ; C9.1 39.63,70.21 R4.1
  Top Layer w0.8: R3.2 R4.1

## Copper pours and planes (outline as drawn; the poured copper is in the pictures)
+3.3V on Top Layer: 40.38,69.31 40.38,83.9 45.47,83.9 45.47,81.97 46.48,81.97 46.48,74.85 53.97,74.85 53.97,83.74 92.33,83.74 92.33,69.52 40.51,69.52 40.39,69.39 40.39,69.32
+3.3V on Top Layer: 40.51,70.86 40.51,68.93 39.8,68.93 39.75,68.89 39.75,62.56 39.78,62.53 41.54,62.53 41.54,68.89 86.49,68.89 86.61,69.01 86.61,70.23 85.98,70.86
+3.3V on Top Layer: 86.11,55 92.24,55 92.33,54.92 92.33,70.79 86.11,70.79
+12V on Top Layer: 0,83.54 32.26,83.54 32.26,76.12 0,76.12
+12V on Bottom Layer: 0,100 13.46,100 13.46,78.66 0,78.66
GND on Top Layer: -23.88,104.95 152.78,104.95 152.78,-4.39 -23.88,-4.39
GND on Top Layer: 0,84 29.67,84 29.67,84.97 34.42,84.97 34.42,77.65 35.57,77.65 35.57,84.98 37.85,84.98 37.85,77.64 38.98,77.64 38.99,77.65 38.99,86.03 45.85,86.03 45.85,88.84 53.72,88.84 53.72,84.12 92.2,84.12 92.33,84.25 92.33,100 12.71,100 12.71,93.4 7.16,93.4 7.03,93.52 7.03,100 0,100
GND on Top Layer: -13.21,112.45 151.64,112.45 151.64,-27.25 -13.21,-27.25
GND on Bottom Layer: -33.27,126.8 166.75,126.8 166.75,-16.97 -33.27,-16.97

Small or netless copper shapes (teardrops, artwork), in the pictures only: 68 on Top Layer, 36 on Bottom Layer

## Text on the board
Top Silkscreen Layer: 电机驱动模块 | ESP32 | STM32F103C8T6最小系统板 | 右前轮 | 电源接口12V | 左后轮 | 右后轮 | 供电口12V | 上位机传输接口 | 降压模块3.3V
